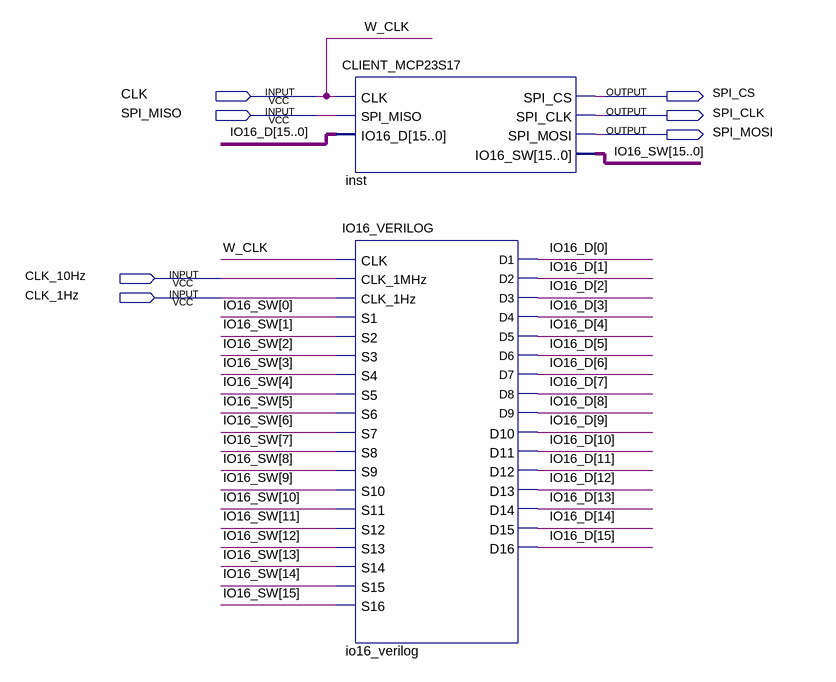
[diagram p0: schematic sheet]
// Quartus schematic APP_IO_EXPANDER.bdf as structural Verilog: 2 symbols, 7 pins
module APP_IO_EXPANDER (
  input  CLK,
  input  SPI_MISO,
  input  CLK_10Hz,
  input  CLK_1Hz,
  output SPI_CS,
  output SPI_CLK,
  output SPI_MOSI
);

  wire [15:0] IO16_D, IO16_SW;

  CLIENT_MCP23S17 inst (
    .CLK(CLK), .SPI_MISO(SPI_MISO), .IO16_D(IO16_D), .SPI_CS(SPI_CS), .SPI_CLK(SPI_CLK), .SPI_MOSI(SPI_MOSI),
    .IO16_SW(IO16_SW));
  IO16_VERILOG io16_verilog (
    .CLK(CLK), .CLK_1MHz(CLK_10Hz), .CLK_1Hz(CLK_1Hz), .S1(IO16_SW[0]), .S2(IO16_SW[1]), .S3(IO16_SW[2]),
    .S4(IO16_SW[3]), .S5(IO16_SW[4]), .S6(IO16_SW[5]), .S7(IO16_SW[6]), .S8(IO16_SW[7]), .S9(IO16_SW[8]),
    .S10(IO16_SW[9]), .S11(IO16_SW[10]), .S12(IO16_SW[11]), .S13(IO16_SW[12]), .S14(IO16_SW[13]),
    .S15(IO16_SW[14]), .S16(IO16_SW[15]), .D1(IO16_D[0]), .D2(IO16_D[1]), .D3(IO16_D[2]), .D4(IO16_D[3]),
    .D5(IO16_D[4]), .D6(IO16_D[5]), .D7(IO16_D[6]), .D8(IO16_D[7]), .D9(IO16_D[8]), .D10(IO16_D[9]),
    .D11(IO16_D[10]), .D12(IO16_D[11]), .D13(IO16_D[12]), .D14(IO16_D[13]), .D15(IO16_D[14]), .D16(IO16_D[15]));

  // Other names for the same wires on the sheet: W_CLK = CLK
endmodule
